# Altium schematic sheet DMC.SchDoc
size A2
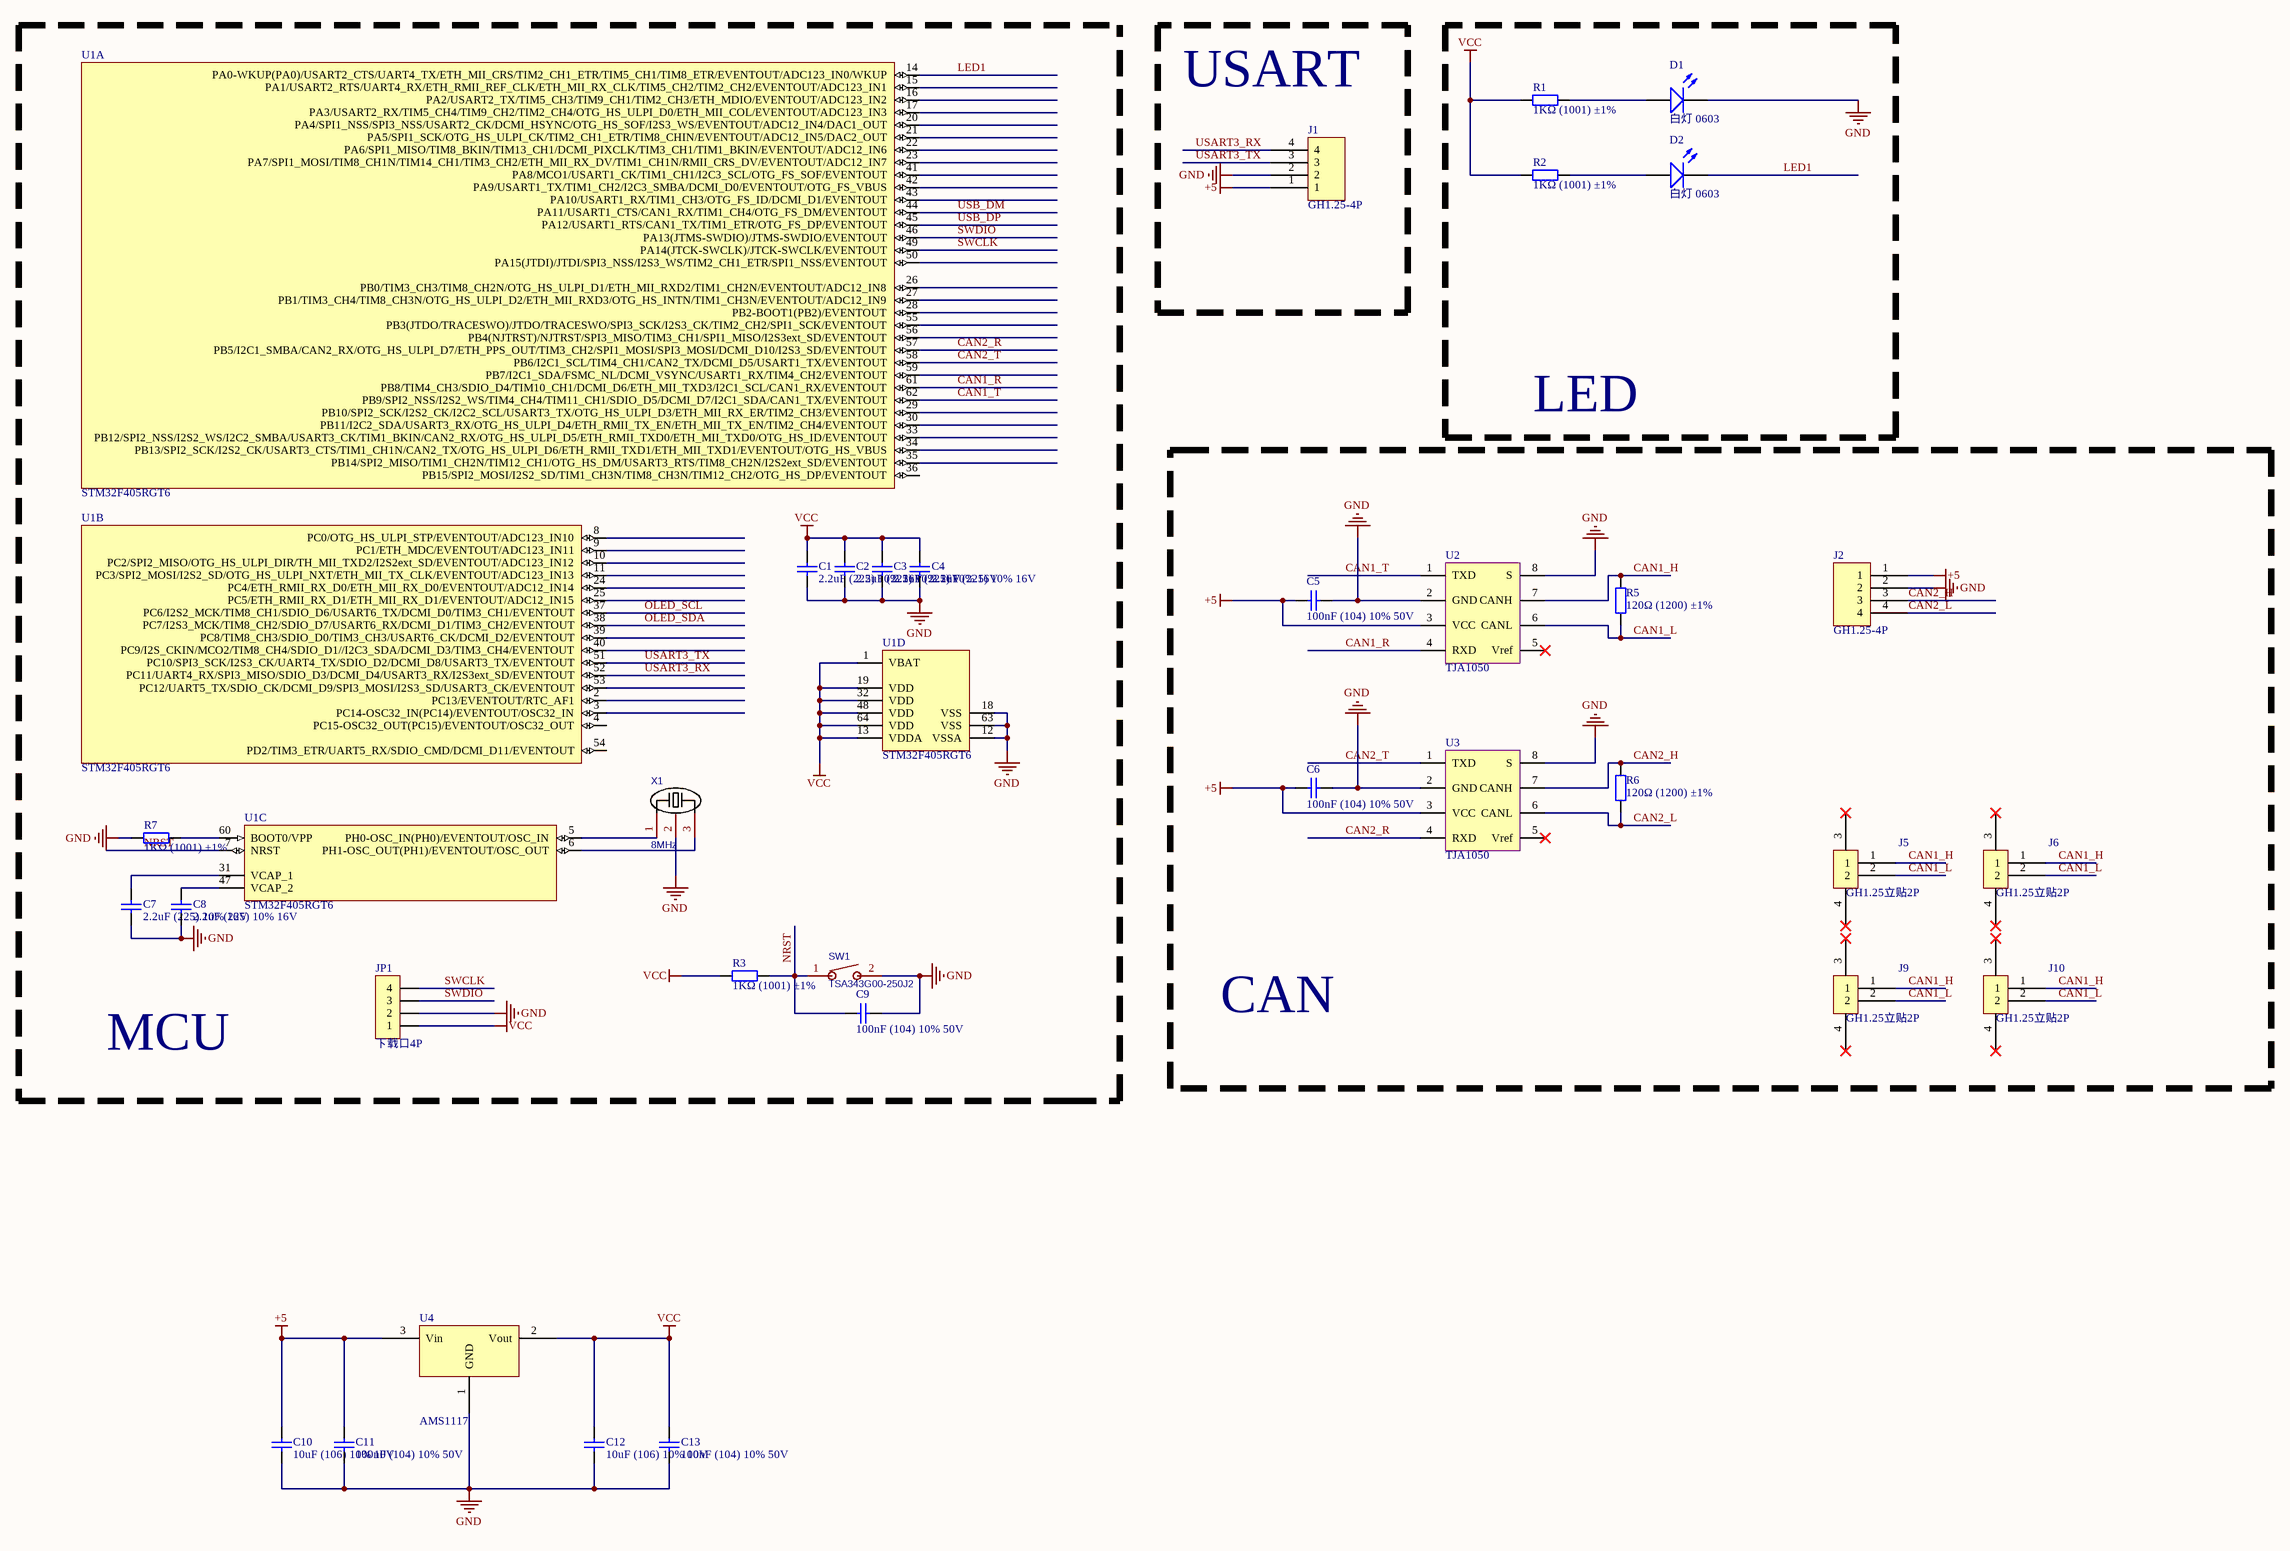
[diagram p0: DMC.SchDoc]

## Parts
C1  2.2uF (225) 10% 16V  [0603_C]
C2  2.2uF (225) 10% 16V  [0603_C]
C3  2.2uF (225) 10% 16V  [0603_C]
C4  2.2uF (225) 10% 16V  [0603_C]
C5  100nF (104) 10% 50V  [0603_C]
C6  100nF (104) 10% 50V  [0603_C]
C7  2.2uF (225) 10% 16V  [0603_C]
C8  2.2uF (225) 10% 16V  [0603_C]
C9  100nF (104) 10% 50V  [0603_C]
C10  10uF (106) 10% 10V  [0603_C]
C11  100nF (104) 10% 50V  [0603_C]
C12  10uF (106) 10% 10V  [0603_C]
C13  100nF (104) 10% 50V  [0603_C]
D1  白灯 0603  [0603_LED_S1]
D2  白灯 0603  [0603_LED_S1]
J1  GH1.25-4P  [GH1.25-4P]
J2  GH1.25-4P  [GH1.25-4P]
J5  GH1.25立贴2P  [CONN-SMD_2P-V-P1.25-L_X1251WVS-02HF-LPSW]
J6  GH1.25立贴2P  [CONN-SMD_2P-V-P1.25-L_X1251WVS-02HF-LPSW]
J9  GH1.25立贴2P  [CONN-SMD_2P-V-P1.25-L_X1251WVS-02HF-LPSW]
J10  GH1.25立贴2P  [CONN-SMD_2P-V-P1.25-L_X1251WVS-02HF-LPSW]
JP1  下载口4P  [下载口4pin]
R1  1KΩ (1001) ±1%  [0603_R]
R2  1KΩ (1001) ±1%  [0603_R]
R3  1KΩ (1001) ±1%  [0603_R]
R5  120Ω (1200) ±1%  [0603_R]
R6  120Ω (1200) ±1%  [0603_R]
R7  1KΩ (1001) ±1%  [0603_R]
SW1  TSA343G00-250J2  [SW-SMD_L4.0-W2.9-LS5.0]
U1  STM32F405RGT6  [TQFP64_M]  (parts A,B,C,D of 4)
U2  TJA1050  [SOIC-8_L5.0-W4.0-P1.27-LS6.0-BL]
U3  TJA1050  [SOIC-8_L5.0-W4.0-P1.27-LS6.0-BL]
U4  AMS1117  [SOT-223_L6.7-W3.5-P2.30-BR]
X1  8MHz  [OSC-SMD_3P-L3.2-W1.3-P1.2-L]

## Blocks framed on the sheet
MCU: C1-C4 C7-C9 JP1 R3 R7 SW1 U1 X1
USART: J1
LED: D1 D2 R1 R2
CAN: C5 C6 J2 J5 J6 J9 J10 R5 R6 U2 U3

## Nets
+5: C5.2 C6.2 C10.2 C11.1 J1.1 J2.1 U2.3(VCC) U3.3(VCC) U4.3(Vin)
GND: C1.1 C2.1 C3.1 C4.1 C5.1 C6.1 C7.1 C8.1 C9.1 C10.1 C11.2 C12.1 C13.2 D1.K J1.2 J2.2 JP1.2 R7.1 SW1.2 U1.12(VSSA) U1.18(VSS) U1.63(VSS) U2.2(GND) U2.8(S) U3.2(GND) U3.8(S) U4.1(GND) X1.2
VCC: C1.2 C2.2 C3.2 C4.2 C12.2 C13.1 JP1.1 R1.1 R2.1 R3.1 U1.1(VBAT) U1.13(VDDA) U1.19(VDD) U1.32(VDD) U1.48(VDD) U1.64(VDD) U4.2(Vout)
CAN1_H: J5.1 J6.1 J9.1 J10.1 R5.2 U2.7(CANH)
CAN1_L: J5.2 J6.2 J9.2 J10.2 R5.1 U2.6(CANL)
CAN1_R: U1.61(PB8/TIM4_CH3/SDIO_D4/TIM10_CH1/DCMI_D6/ETH_MII_TXD3/I2C1_SCL/CAN1_RX/EVENTOUT) U2.4(RXD)
CAN1_T: U1.62(PB9/SPI2_NSS/I2S2_WS/TIM4_CH4/TIM11_CH1/SDIO_D5/DCMI_D7/I2C1_SDA/CAN1_TX/EVENTOUT) U2.1(TXD)
CAN2_H: J2.3 R6.2 U3.7(CANH)
CAN2_L: J2.4 R6.1 U3.6(CANL)
CAN2_R: U1.57(PB5/I2C1_SMBA/CAN2_RX/OTG_HS_ULPI_D7/ETH_PPS_OUT/TIM3_CH2/SPI1_MOSI/SPI3_MOSI/DCMI_D10/I2S3_SD/EVENTOUT) U3.4(RXD)
CAN2_T: U1.58(PB6/I2C1_SCL/TIM4_CH1/CAN2_TX/DCMI_D5/USART1_TX/EVENTOUT) U3.1(TXD)
LED1: D2.K U1.14(PA0-WKUP(PA0)/USART2_CTS/UART4_TX/ETH_MII_CRS/TIM2_CH1_ETR/TIM5_CH1/TIM8_ETR/EVENTOUT/ADC123_IN0/WKUP)
NRST: C9.2 R3.2 SW1.1 U1.7(NRST)
OLED_SCL: U1.37(PC6/I2S2_MCK/TIM8_CH1/SDIO_D6/USART6_TX/DCMI_D0/TIM3_CH1/EVENTOUT)
OLED_SDA: U1.38(PC7/I2S3_MCK/TIM8_CH2/SDIO_D7/USART6_RX/DCMI_D1/TIM3_CH2/EVENTOUT)
SWCLK: JP1.4 U1.49(PA14(JTCK-SWCLK)/JTCK-SWCLK/EVENTOUT)
SWDIO: JP1.3 U1.46(PA13(JTMS-SWDIO)/JTMS-SWDIO/EVENTOUT)
USART3_RX: J1.4 U1.52(PC11/UART4_RX/SPI3_MISO/SDIO_D3/DCMI_D4/USART3_RX/I2S3ext_SD/EVENTOUT)
USART3_TX: J1.3 U1.51(PC10/SPI3_SCK/I2S3_CK/UART4_TX/SDIO_D2/DCMI_D8/USART3_TX/EVENTOUT)
USB_DM: U1.44(PA11/USART1_CTS/CAN1_RX/TIM1_CH4/OTG_FS_DM/EVENTOUT)
USB_DP: U1.45(PA12/USART1_RTS/CAN1_TX/TIM1_ETR/OTG_FS_DP/EVENTOUT)
NetC7_2: C7.2 U1.31(VCAP_1)
NetC8_2: C8.2 U1.47(VCAP_2)
NetD1_A: D1.A R1.2
NetD2_A: D2.A R2.2
NetR7_2: R7.2 U1.60(BOOT0/VPP)
NetU1_5: U1.5(PH0-OSC_IN(PH0)/EVENTOUT/OSC_IN) X1.1
NetU1_6: U1.6(PH1-OSC_OUT(PH1)/EVENTOUT/OSC_OUT) X1.3

Not connected (* = marked no-connect by the designer): J5 3* 4*; J6 3* 4*; J9 3* 4*; J10 3* 4*; U1 2(PC13/EVENTOUT/RTC_AF1) 3(PC14-OSC32_IN(PC14)/EVENTOUT/OSC32_IN) 4(PC15-OSC32_OUT(PC15)/EVENTOUT/OSC32_OUT) 8(PC0/OTG_HS_ULPI_STP/EVENTOUT/ADC123_IN10) 9(PC1/ETH_MDC/EVENTOUT/ADC123_IN11) 10(PC2/SPI2_MISO/OTG_HS_ULPI_DIR/TH_MII_TXD2/I2S2ext_SD/EVENTOUT/ADC123_IN12) 11(PC3/SPI2_MOSI/I2S2_SD/OTG_HS_ULPI_NXT/ETH_MII_TX_CLK/EVENTOUT/ADC123_IN13) 15(PA1/USART2_RTS/UART4_RX/ETH_RMII_REF_CLK/ETH_MII_RX_CLK/TIM5_CH2/TIM2_CH2/EVENTOUT/ADC123_IN1) 16(PA2/USART2_TX/TIM5_CH3/TIM9_CH1/TIM2_CH3/ETH_MDIO/EVENTOUT/ADC123_IN2) 17(PA3/USART2_RX/TIM5_CH4/TIM9_CH2/TIM2_CH4/OTG_HS_ULPI_D0/ETH_MII_COL/EVENTOUT/ADC123_IN3) 20(PA4/SPI1_NSS/SPI3_NSS/USART2_CK/DCMI_HSYNC/OTG_HS_SOF/I2S3_WS/EVENTOUT/ADC12_IN4/DAC1_OUT) 21(PA5/SPI1_SCK/OTG_HS_ULPI_CK/TIM2_CH1_ETR/TIM8_CHIN/EVENTOUT/ADC12_IN5/DAC2_OUT) 22(PA6/SPI1_MISO/TIM8_BKIN/TIM13_CH1/DCMI_PIXCLK/TIM3_CH1/TIM1_BKIN/EVENTOUT/ADC12_IN6) 23(PA7/SPI1_MOSI/TIM8_CH1N/TIM14_CH1/TIM3_CH2/ETH_MII_RX_DV/TIM1_CH1N/RMII_CRS_DV/EVENTOUT/ADC12_IN7) 24(PC4/ETH_RMII_RX_D0/ETH_MII_RX_D0/EVENTOUT/ADC12_IN14) 25(PC5/ETH_RMII_RX_D1/ETH_MII_RX_D1/EVENTOUT/ADC12_IN15) 26(PB0/TIM3_CH3/TIM8_CH2N/OTG_HS_ULPI_D1/ETH_MII_RXD2/TIM1_CH2N/EVENTOUT/ADC12_IN8) 27(PB1/TIM3_CH4/TIM8_CH3N/OTG_HS_ULPI_D2/ETH_MII_RXD3/OTG_HS_INTN/TIM1_CH3N/EVENTOUT/ADC12_IN9) 28(PB2-BOOT1(PB2)/EVENTOUT) 29(PB10/SPI2_SCK/I2S2_CK/I2C2_SCL/USART3_TX/OTG_HS_ULPI_D3/ETH_MII_RX_ER/TIM2_CH3/EVENTOUT) 30(PB11/I2C2_SDA/USART3_RX/OTG_HS_ULPI_D4/ETH_RMII_TX_EN/ETH_MII_TX_EN/TIM2_CH4/EVENTOUT) 33(PB12/SPI2_NSS/I2S2_WS/I2C2_SMBA/USART3_CK/TIM1_BKIN/CAN2_RX/OTG_HS_ULPI_D5/ETH_RMII_TXD0/ETH_MII_TXD0/OTG_HS_ID/EVENTOUT) 34(PB13/SPI2_SCK/I2S2_CK/USART3_CTS/TIM1_CH1N/CAN2_TX/OTG_HS_ULPI_D6/ETH_RMII_TXD1/ETH_MII_TXD1/EVENTOUT/OTG_HS_VBUS) 35(PB14/SPI2_MISO/TIM1_CH2N/TIM12_CH1/OTG_HS_DM/USART3_RTS/TIM8_CH2N/I2S2ext_SD/EVENTOUT) 36(PB15/SPI2_MOSI/I2S2_SD/TIM1_CH3N/TIM8_CH3N/TIM12_CH2/OTG_HS_DP/EVENTOUT) 39(PC8/TIM8_CH3/SDIO_D0/TIM3_CH3/USART6_CK/DCMI_D2/EVENTOUT) 40(PC9/I2S_CKIN/MCO2/TIM8_CH4/SDIO_D1//I2C3_SDA/DCMI_D3/TIM3_CH4/EVENTOUT) 41(PA8/MCO1/USART1_CK/TIM1_CH1/I2C3_SCL/OTG_FS_SOF/EVENTOUT) 42(PA9/USART1_TX/TIM1_CH2/I2C3_SMBA/DCMI_D0/EVENTOUT/OTG_FS_VBUS) 43(PA10/USART1_RX/TIM1_CH3/OTG_FS_ID/DCMI_D1/EVENTOUT) 50(PA15(JTDI)/JTDI/SPI3_NSS/I2S3_WS/TIM2_CH1_ETR/SPI1_NSS/EVENTOUT) 53(PC12/UART5_TX/SDIO_CK/DCMI_D9/SPI3_MOSI/I2S3_SD/USART3_CK/EVENTOUT) 54(PD2/TIM3_ETR/UART5_RX/SDIO_CMD/DCMI_D11/EVENTOUT) 55(PB3(JTDO/TRACESWO)/JTDO/TRACESWO/SPI3_SCK/I2S3_CK/TIM2_CH2/SPI1_SCK/EVENTOUT) 56(PB4(NJTRST)/NJTRST/SPI3_MISO/TIM3_CH1/SPI1_MISO/I2S3ext_SD/EVENTOUT) 59(PB7/I2C1_SDA/FSMC_NL/DCMI_VSYNC/USART1_RX/TIM4_CH2/EVENTOUT); U2 5(Vref)*; U3 5(Vref)*

## Library data of the parts
C1-C4 C7 C8 = 0603 2.2uF (225) 10% 16V: 贴片电容; ComponentLink1Description: 供应商链接; ComponentLink1URL: http://www.szlcsc.com/product/details_24366.html; Package: 0603; Supplier: LC; SuppliersPartNumber: C23630
C5 C6 C9 C11 C13 = 0603 100nF (104) 10% 50V: 贴片电容; ComponentLink1Description: 供应商链接; ComponentLink1URL: http://www.szlcsc.com/product/details_15331.html; Package: 0603; Supplier: LC; SuppliersPartNumber: C14663
C10 C12 = 0603 10uF (106) 10% 10V: 贴片电容; ComponentLink1Description: 供应商链接; ComponentLink1URL: http://www.szlcsc.com/product/details_20411.html; Package: 0603; Supplier: LC; SuppliersPartNumber: C19702
D1 D2 = 0603 白灯: 发光二极管; ComponentLink1Description: 供应商链接; ComponentLink1URL: http://www.szlcsc.com/product/details_2663.html; Package: 0603; Supplier: LC; SuppliersPartNumber: C2290
J1 J2 = GH1.25-4P: GH1.25-4P 卧
JP1 = 接插件-下载口4P: 下载口4PIN SWD
R1-R3 R7 = 0603 1KΩ (1001) 1%: 贴片电阻; ComponentLink1Description: 供应商链接; ComponentLink1URL: http://www.szlcsc.com/product/details_21904.html; Package: 0603; Supplier: LC; SuppliersPartNumber: C21190
R5 R6 = 0603 120Ω (1200) 1%: 贴片电阻; ComponentLink1Description: 供应商链接; ComponentLink1URL: http://www.szlcsc.com/product/details_23514.html; Package: 0603; Supplier: LC; SuppliersPartNumber: C22787
SW1 = TSA343G00-250J2: 贴片轻触开关; BOM_Manufacturer: BRIGHT; Contributor: LCSC; BOM_Supplier: LCSC; BOM_Supplier Part: C354946; BOM_Manufacturer Part: TSA343G00-250J2; spicePre: S; spiceSymbolName: TSA343G00-250J2
U1 = STM32F405RGT6: ARM Cortex-M4 32b MCU+FPU, 210DMIP, 1024 kB Flash, 192+4 kB RAM, 51 I/Os, 64-pin LQFP, -40 to +85癈, Tray; Internal RAM: 192kB; Operating Frequency (Processor Speed): 168MHz; A/D Converter: 16x12-bit; D/A Converter: 2x12-bit; 16-bit Timers (IC/OC/PWM): 12x16-bit(24/24/30); 32-bit Timer (IC/OC/PWM): 2x32-bit (8/8/8); Other Timer Functions: 2xWDG, RTC, 24-bit down counter; Serial Interface: 3xSPI/2xI2S/2xI2C/3xUSART(IrDa, ISO7816)/3xUART/1xUSB OTG FS/HS, 2xCAN/ SDIO; DatasheetVersion: rev2, Jan-2012; PackageVersion: 2012; PackageReference: TQFP64; PackageDescription: 64-Pin Low Profile Quad Flat Package, 10x10 mm Body, 0.5 mm Pitch; ComponentLink1Description: Manufacturer URL; ComponentLink1URL: http://www.st.com/; ComponentLink2Description: STM32F405/7 Datasheet; ComponentLink2URL: http://www.st.com/internet/com/TECHNICAL_RESOURCES/TECHNICAL_LITERATURE/DATASHEET/DM00037051.pdf; ComponentLink3Description: STM32F4 Web Page; ComponentLink3URL: http://www.st.com/internet/mcu/subclass/1521.jsp
X1 = 8MHz-3P: BOM_Manufacturer: MuRata; BOM_Manufacturer Part: CSTCE8M00G15C99-R0; nameAlias: Frequency; SMT Type: Extend; BOM_Supplier: LCSC; BOM_Supplier Part: C110614; BOM_JLCPCB SMD: Yes; spicePre: X; spiceSymbolName: CSTCE8M00G15C99-R0